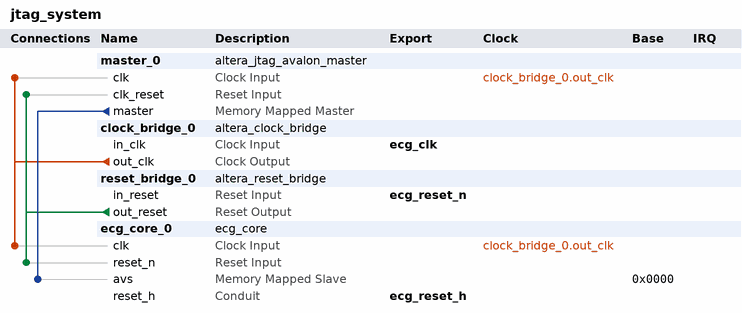
[diagram p0: system contents]
# Platform Designer (Qsys) system jtag_system, Cyclone V 5CSXFC6D6F31C6
# Parameters at their usual value, and those the tool derives, are not listed.
package require -exact qsys 25.1
create_system jtag_system
set_project_property DEVICE_FAMILY {Cyclone V}
set_project_property DEVICE 5CSXFC6D6F31C6

add_instance master_0 altera_jtag_avalon_master 25.1

add_instance clock_bridge_0 altera_clock_bridge 25.1
set_instance_parameter_value clock_bridge_0 DERIVED_CLOCK_RATE 0
set_instance_parameter_value clock_bridge_0 EXPLICIT_CLOCK_RATE 0

add_instance reset_bridge_0 altera_reset_bridge 25.1
set_instance_parameter_value reset_bridge_0 ACTIVE_LOW_RESET 1
set_instance_parameter_value reset_bridge_0 SYNCHRONOUS_EDGES none

add_instance ecg_core_0 ecg_core 1.0

# connections
add_connection clock_bridge_0.out_clk ecg_core_0.clk clock
add_connection clock_bridge_0.out_clk master_0.clk clock
add_connection reset_bridge_0.out_reset ecg_core_0.reset_n reset
add_connection reset_bridge_0.out_reset master_0.clk_reset reset
add_connection master_0.master ecg_core_0.avs avalon
set_connection_parameter_value master_0.master/ecg_core_0.avs baseAddress 0x0000

# exported interfaces
add_interface ecg_clk clock sink
set_interface_property ecg_clk EXPORT_OF clock_bridge_0.in_clk
add_interface ecg_reset_h conduit end
set_interface_property ecg_reset_h EXPORT_OF ecg_core_0.reset_h
add_interface ecg_reset_n reset sink
set_interface_property ecg_reset_n EXPORT_OF reset_bridge_0.in_reset

set_interconnect_requirement {$system} qsys_mm.clockCrossingAdapter HANDSHAKE
set_interconnect_requirement {$system} qsys_mm.enableEccProtection FALSE
set_interconnect_requirement {$system} qsys_mm.insertDefaultSlave FALSE
set_interconnect_requirement {$system} qsys_mm.maxAdditionalLatency 1

save_system jtag_system.qsys
